# EAGLE design Omnimem (EAGLE 6.6.0)

## Sheet 1 of 3
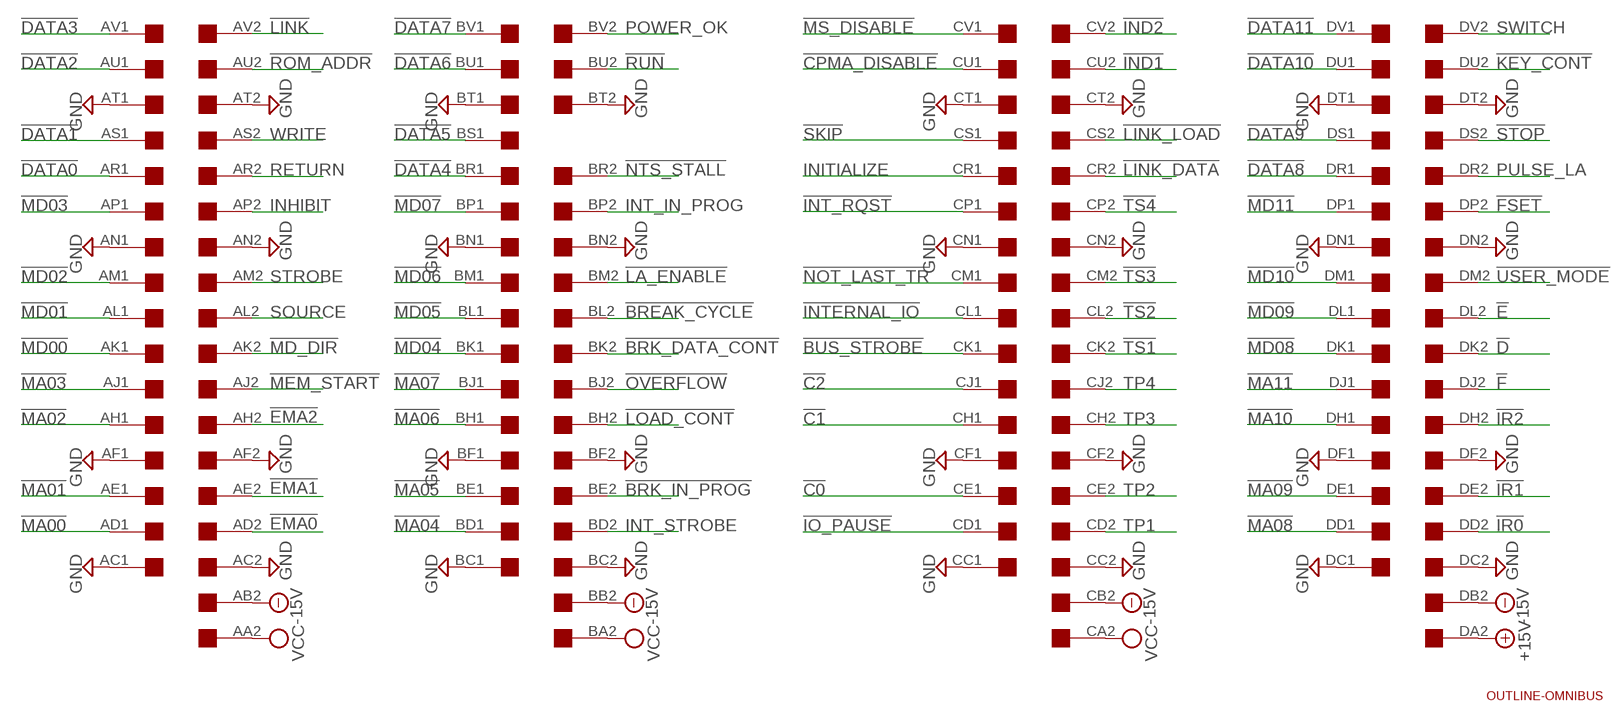
[diagram p0: schematic, sheet 1]

### Parts
U$1  OUTLINE-OMNIBUS  [OMNIBUS]
U$2  QUAD  [EDGE-CON8]

### Nets
!BREAK_CYCLE: U$2.BL2
!BRK_DATA_CONT: U$2.BK2
!BRK_IN_PROG: U$2.BE2
!BUS_STROBE: U$2.CK1
!C0: U$2.CE1
!C1: U$2.CH1
!C2: U$2.CJ1
!CPMA_DISABLE: U$2.CU1
!D: U$2.DK2
!DATA0: U$2.AR1
!DATA1: U$2.AS1
!DATA2: U$2.AU1
!DATA3: U$2.AV1
!DATA4: U$2.BR1
!DATA5: U$2.BS1
!DATA6: U$2.BU1
!DATA7: U$2.BV1
!DATA8: U$2.DR1
!DATA9: U$2.DS1
!DATA10: U$2.DU1
!DATA11: U$2.DV1
!E: U$2.DL2
!EMA0: U$2.AD2 ; also sheet 2
!EMA1: U$2.AE2 ; also sheet 2
!EMA2: U$2.AH2 ; also sheet 2
!F: U$2.DJ2
!FSET: U$2.DP2
!IND1: U$2.CU2
!IND2: U$2.CV2
!INT_RQST: U$2.CP1
!INTERNAL_IO: U$2.CL1
!IO_PAUSE: U$2.CD1
!IR0: U$2.DD2
!IR1: U$2.DE2
!IR2: U$2.DH2
!KEY_CONT: U$2.DU2
!LA_ENABLE: U$2.BM2
!LINK: U$2.AV2
!LINK_DATA: U$2.CR2
!LINK_LOAD: U$2.CS2
!LOAD_CONT: U$2.BH2
!MA00: U$2.AD1 ; also sheet 2
!MA01: U$2.AE1 ; also sheet 2
!MA02: U$2.AH1 ; also sheet 2
!MA03: U$2.AJ1 ; also sheet 2
!MA04: U$2.BD1 ; also sheet 2
!MA05: U$2.BE1 ; also sheet 2
!MA06: U$2.BH1 ; also sheet 2
!MA07: U$2.BJ1 ; also sheet 2
!MA08: U$2.DD1 ; also sheet 2
!MA09: U$2.DE1 ; also sheet 2
!MA10: U$2.DH1 ; also sheet 2
!MA11: U$2.DJ1 ; also sheet 2
!MD00: U$2.AK1 ; also sheet 2
!MD01: U$2.AL1 ; also sheet 2
!MD02: U$2.AM1 ; also sheet 2
!MD03: U$2.AP1 ; also sheet 2
!MD04: U$2.BK1 ; also sheet 2
!MD05: U$2.BL1 ; also sheet 2
!MD06: U$2.BM1 ; also sheet 2
!MD07: U$2.BP1 ; also sheet 2
!MD08: U$2.DK1 ; also sheet 2
!MD09: U$2.DL1 ; also sheet 2
!MD10: U$2.DM1 ; also sheet 2
!MD11: U$2.DP1 ; also sheet 2
!MD_DIR: U$2.AK2
!MEM_START: U$2.AJ2
!MS_DISABLE: U$2.CV1
!NOT_LAST_TR: U$2.CM1
!NTS_STALL: U$2.BR2
!OVERFLOW: U$2.BJ2
!ROM_ADDR: U$2.AU2 ; also sheet 2
!RUN: U$2.BU2
!SKIP: U$2.CS1
!STOP: U$2.DS2
!TS1: U$2.CK2
!TS2: U$2.CL2
!TS3: U$2.CM2
!TS4: U$2.CP2
!USER_MODE: U$2.DM2
+15V: U$2.DA2
-15V [supply]: U$2.AB2 U$2.BB2 U$2.CB2 U$2.DB2
GND [supply]: U$2.AC1 U$2.AC2 U$2.AF1 U$2.AF2 U$2.AN1 U$2.AN2 U$2.AT1 U$2.AT2 U$2.BC1 U$2.BC2 U$2.BF1 U$2.BF2 U$2.BN1 U$2.BN2 U$2.BT1 U$2.BT2 U$2.CC1 U$2.CC2 U$2.CF1 U$2.CF2 U$2.CN1 U$2.CN2 U$2.CT1 U$2.CT2 U$2.DC1 U$2.DC2 U$2.DF1 U$2.DF2 U$2.DN1 U$2.DN2 U$2.DT1 U$2.DT2 ; also sheet 2,3
INHIBIT: U$2.AP2
INITIALIZE: U$2.CR1
INT_IN_PROG: U$2.BP2
INT_STROBE: U$2.BD2
POWER_OK: U$2.BV2
PULSE_LA: U$2.DR2
RETURN: U$2.AR2
SOURCE: U$2.AL2
STROBE: U$2.AM2
SWITCH: U$2.DV2
TP1: U$2.CD2
TP2: U$2.CE2
TP3: U$2.CH2
TP4: U$2.CJ2
VCC [supply]: U$2.AA2 U$2.BA2 U$2.CA2 ; also sheet 2
WRITE: U$2.AS2 ; also sheet 2
Unconnected: U$2.AA1 U$2.AB1 U$2.BA1 U$2.BB1 U$2.BS2 U$2.CA1 U$2.CB1 U$2.DA1 U$2.DB1

## Sheet 2 of 3
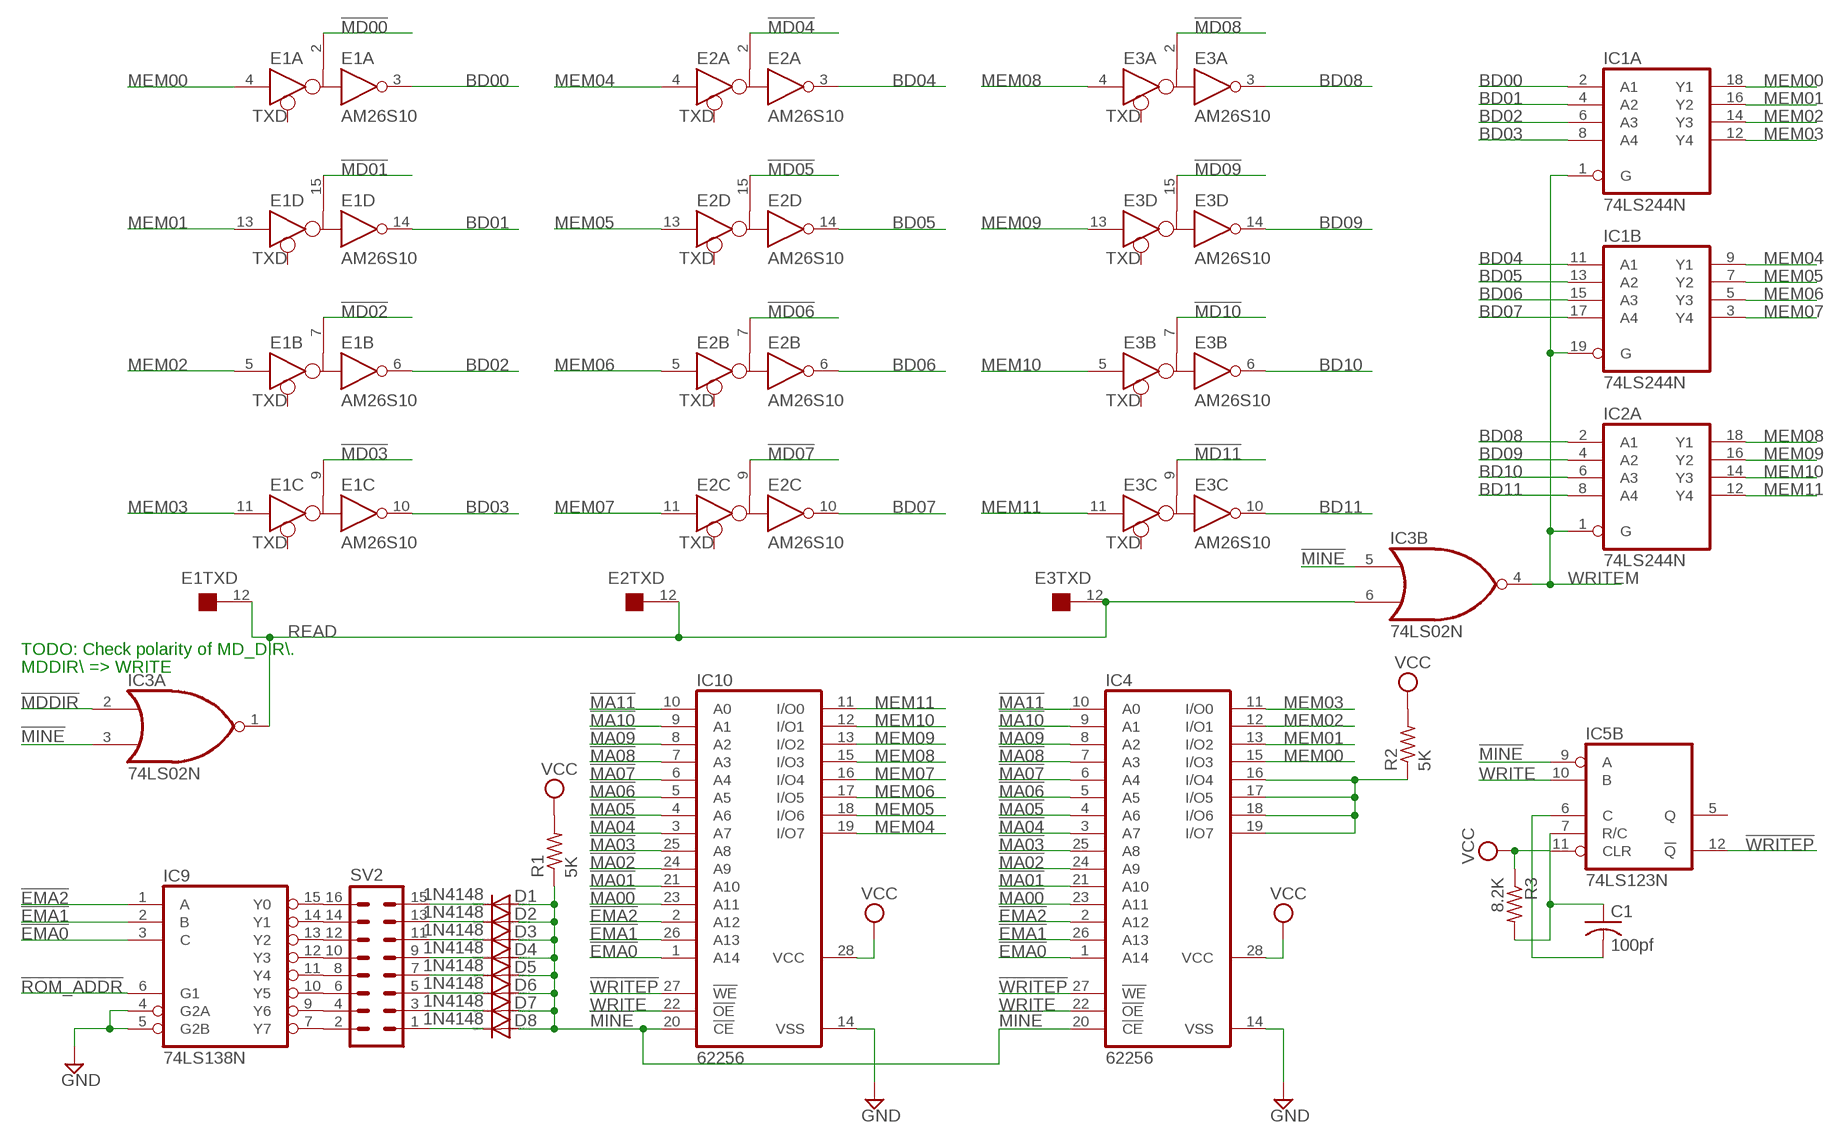
[diagram p1: schematic, sheet 2]

### Parts
C1  100pf  C-US050-025X075  [C050-025X075]
D1  1N4148  1N4148DO35-10  [DO35-10]
D2  1N4148  1N4148DO35-10  [DO35-10]
D3  1N4148  1N4148DO35-10  [DO35-10]
D4  1N4148  1N4148DO35-10  [DO35-10]
D5  1N4148  1N4148DO35-10  [DO35-10]
D6  1N4148  1N4148DO35-10  [DO35-10]
D7  1N4148  1N4148DO35-10  [DO35-10]
D8  1N4148  1N4148DO35-10  [DO35-10]
E1  AM26S10  [DIL16]
E2  AM26S10  [DIL16]
E3  AM26S10  [DIL16]
IC1  74LS244N  [DIL20]
IC2  74LS244N  [DIL20]
IC3  74LS02N  [DIL14]
IC4  62256  58C256P  [DIL28-6]
IC5  74LS123N  [DIL16]
IC9  74LS138N  [DIL16]
IC10  62256  58C256P  [DIL28-6]
R1  5K  R-US_0207/10  [0207/10]
R2  5K  R-US_0207/10  [0207/10]
R3  8.2K  R-US_0207/10  [0207/10]
SV2  MA08-2  [MA08-2]

### Nets
!EMA0: IC4.1(A14) IC9.3(C) IC10.1(A14) ; also sheet 1
!EMA1: IC4.26(A13) IC9.2(B) IC10.26(A13) ; also sheet 1
!EMA2: IC4.2(A12) IC9.1(A) IC10.2(A12) ; also sheet 1
!MA00: IC4.23(A11) IC10.23(A11) ; also sheet 1
!MA01: IC4.21(A10) IC10.21(A10) ; also sheet 1
!MA02: IC4.24(A9) IC10.24(A9) ; also sheet 1
!MA03: IC4.25(A8) IC10.25(A8) ; also sheet 1
!MA04: IC4.3(A7) IC10.3(A7) ; also sheet 1
!MA05: IC4.4(A6) IC10.4(A6) ; also sheet 1
!MA06: IC4.5(A5) IC10.5(A5) ; also sheet 1
!MA07: IC4.6(A4) IC10.6(A4) ; also sheet 1
!MA08: IC4.7(A3) IC10.7(A3) ; also sheet 1
!MA09: IC4.8(A2) IC10.8(A2) ; also sheet 1
!MA10: IC4.9(A1) IC10.9(A1) ; also sheet 1
!MA11: IC4.10(A0) IC10.10(A0) ; also sheet 1
!MD00: E1.2(A:B) ; also sheet 1
!MD01: E1.15(D:B) ; also sheet 1
!MD02: E1.7(B:B) ; also sheet 1
!MD03: E1.9(C:B) ; also sheet 1
!MD04: E2.2(A:B) ; also sheet 1
!MD05: E2.15(D:B) ; also sheet 1
!MD06: E2.7(B:B) ; also sheet 1
!MD07: E2.9(C:B) ; also sheet 1
!MD08: E3.2(A:B) ; also sheet 1
!MD09: E3.15(D:B) ; also sheet 1
!MD10: E3.7(B:B) ; also sheet 1
!MD11: E3.9(C:B) ; also sheet 1
!MDDIR: IC3.2(A:I0)
!MINE: D1.A D2.A D3.A D4.A D5.A D6.A D7.A D8.A IC3.3(A:I1) IC3.5(B:I0) IC4.20(!CE) IC5.9(B:A) IC10.20(!CE) R1.1
!ROM_ADDR: IC9.6(G1) ; also sheet 1
!WRITEP: IC4.27(!WE) IC5.12(B:!Q) IC10.27(!WE)
BD00: E1.3(A:R) IC1.2(A:A1)
BD01: E1.14(D:R) IC1.4(A:A2)
BD02: E1.6(B:R) IC1.6(A:A3)
BD03: E1.10(C:R) IC1.8(A:A4)
BD04: E2.3(A:R) IC1.11(B:A1)
BD05: E2.14(D:R) IC1.13(B:A2)
BD06: E2.6(B:R) IC1.15(B:A3)
BD07: E2.10(C:R) IC1.17(B:A4)
BD08: E3.3(A:R) IC2.2(A:A1)
BD09: E3.14(D:R) IC2.4(A:A2)
BD10: E3.6(B:R) IC2.6(A:A3)
BD11: E3.10(C:R) IC2.8(A:A4)
GND [supply]: IC4.14(VSS) IC9.4(G2A) IC9.5(G2B) IC10.14(VSS) ; also sheet 1,3
MEM00: E1.4(A:D) IC1.18(A:Y1) IC4.15(I/O3)
MEM01: E1.13(D:D) IC1.16(A:Y2) IC4.13(I/O2)
MEM02: E1.5(B:D) IC1.14(A:Y3) IC4.12(I/O1)
MEM03: E1.11(C:D) IC1.12(A:Y4) IC4.11(I/O0)
MEM04: E2.4(A:D) IC1.9(B:Y1) IC10.19(I/O7)
MEM05: E2.13(D:D) IC1.7(B:Y2) IC10.18(I/O6)
MEM06: E2.5(B:D) IC1.5(B:Y3) IC10.17(I/O5)
MEM07: E2.11(C:D) IC1.3(B:Y4) IC10.16(I/O4)
MEM08: E3.4(A:D) IC2.18(A:Y1) IC10.15(I/O3)
MEM09: E3.13(D:D) IC2.16(A:Y2) IC10.13(I/O2)
MEM10: E3.5(B:D) IC2.14(A:Y3) IC10.12(I/O1)
MEM11: E3.11(C:D) IC2.12(A:Y4) IC10.11(I/O0)
N$1: IC9.7(Y7) SV2.2
N$18: IC9.9(Y6) SV2.4
N$19: IC9.10(Y5) SV2.6
N$20: IC9.11(Y4) SV2.8
N$21: IC9.12(Y3) SV2.10
N$22: IC9.13(Y2) SV2.12
N$23: IC9.14(Y1) SV2.14
N$24: IC9.15(Y0) SV2.16
N$25: C1.1 IC5.7(B:R/C) R3.2
N$26: D8.C SV2.1
N$27: D7.C SV2.3
N$28: D6.C SV2.5
N$29: D5.C SV2.7
N$30: D4.C SV2.9
N$31: D3.C SV2.11
N$32: D2.C SV2.13
N$33: D1.C SV2.15
N$34: C1.2 IC5.6(B:C)
N$35: IC4.16(I/O4) IC4.17(I/O5) IC4.18(I/O6) IC4.19(I/O7) R2.1
READ: E1.12(TXD:TXD) E2.12(TXD:TXD) E3.12(TXD:TXD) IC3.1(A:O) IC3.6(B:I1)
VCC [supply]: IC4.28(VCC) IC5.11(B:CLR) IC10.28(VCC) R1.2 R2.2 R3.1 ; also sheet 1
WRITE: IC4.22(!OE) IC5.10(B:B) IC10.22(!OE) ; also sheet 1
WRITEM: IC1.1(A:G) IC1.19(B:G) IC2.1(A:G) IC3.4(B:O)
Unconnected: IC2.3(B:Y4) IC2.5(B:Y3) IC2.7(B:Y2) IC2.9(B:Y1) IC2.11(B:A1) IC2.13(B:A2) IC2.15(B:A3) IC2.17(B:A4) IC2.19(B:G) IC3.8(C:I0) IC3.9(C:I1) IC3.10(C:O) IC3.11(D:I0) IC3.12(D:I1) IC3.13(D:O) IC5.1(A:A) IC5.2(A:B) IC5.3(A:CLR) IC5.4(A:!Q) IC5.5(B:Q) IC5.13(A:Q) IC5.14(A:C) IC5.15(A:R/C)

### Notes on the sheet
- TODO: Check polarity of MD_DIR\\.
- MDDIR\\ => WRITE

## Sheet 3 of 3
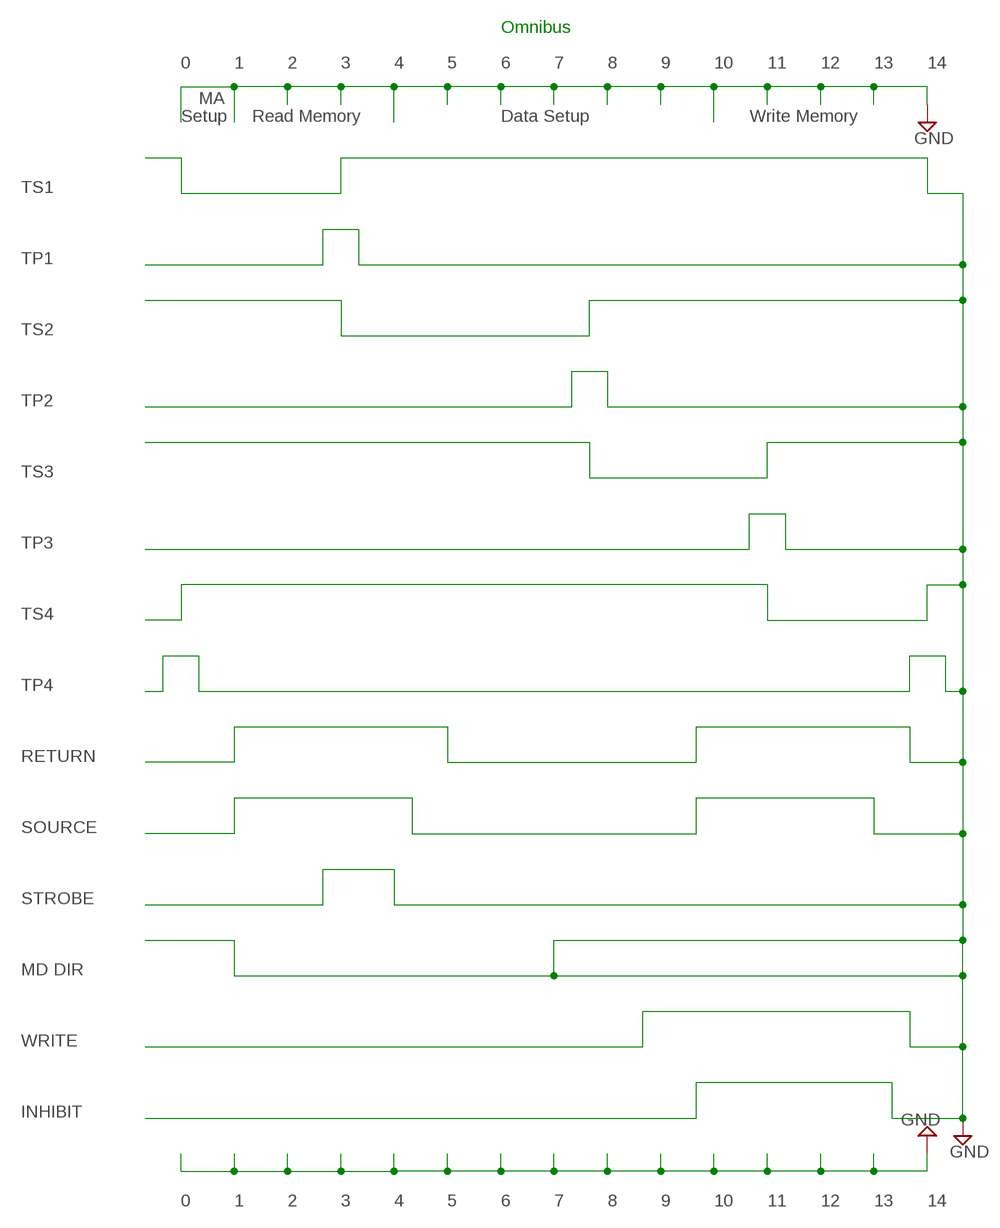
[diagram p2: schematic, sheet 3]

### Notes on the sheet
- Omnibus
- 0 | 1 | 2 | 3 | 4 | 5 | 6 | 7 | 8 | 9 | 10 | 11 | 12 | 13 | 14
- MA
- Setup | Read Memory | Data Setup | Write Memory
- TS1
- TP1
- TS2
- TP2
- TS3
- TP3
- TS4
- TP4
- RETURN
- SOURCE
- STROBE
- MD DIR
- WRITE
- INHIBIT
- 0 | 1 | 2 | 3 | 4 | 5 | 6 | 7 | 8 | 9 | 10 | 11 | 12 | 13 | 14

## Power pins joined to a net without a drawn wire
GND: E1.1(GND:GND) E1.8(PWR:GND) E2.1(GND:GND) E2.8(PWR:GND) E3.1(GND:GND) E3.8(PWR:GND) IC1.10(P:GND) IC2.10(P:GND) IC3.7(P:GND) IC5.8(P:GND) IC9.8(GND)
VCC: E1.16(PWR:VCC) E2.16(PWR:VCC) E3.16(PWR:VCC) IC1.20(P:VCC) IC2.20(P:VCC) IC3.14(P:VCC) IC5.16(P:VCC) IC9.16(VCC)

## Library data of the parts
C1 = rcl:C-US: CAPACITOR, American symbol
D1-D8 = diode:1N4148: DIODE high speed (Philips)
E1-E3 = dec-con:AM26S10: Bus Transceiver
IC1 IC2 = 74xx-us:74*244: Octal BUFFER and LINE DRIVER, 3-state
IC3 = 74xx-us:74*02: Quad 2-input NOR gate
IC4 IC10 = memory-hitachi:58C256P: MEMORY; MPN: HN58C256AP85E; OC_FARNELL: 1496447; OC_NEWARK: 61M6616
IC5 = 74xx-us:74*123: Retriggerable monostable MULTIVIBRATOR
IC9 = 74xx-us:74*138: 3-line to 8-line DECODER/DEMULTIPLEXER
R1-R3 = rcl:R-US_: RESISTOR, American symbol
SV2 = con-lstb:MA08-2: PIN HEADER; OC_FARNELL: unknown; OC_NEWARK: unknown
U$1 = dec-con:OUTLINE-*: Board outlines for DEC boards.
U$2 = dec-con:QUAD: Quad-Height DEC board

## Net classes
1 supply: width 0.762 mm

## Board
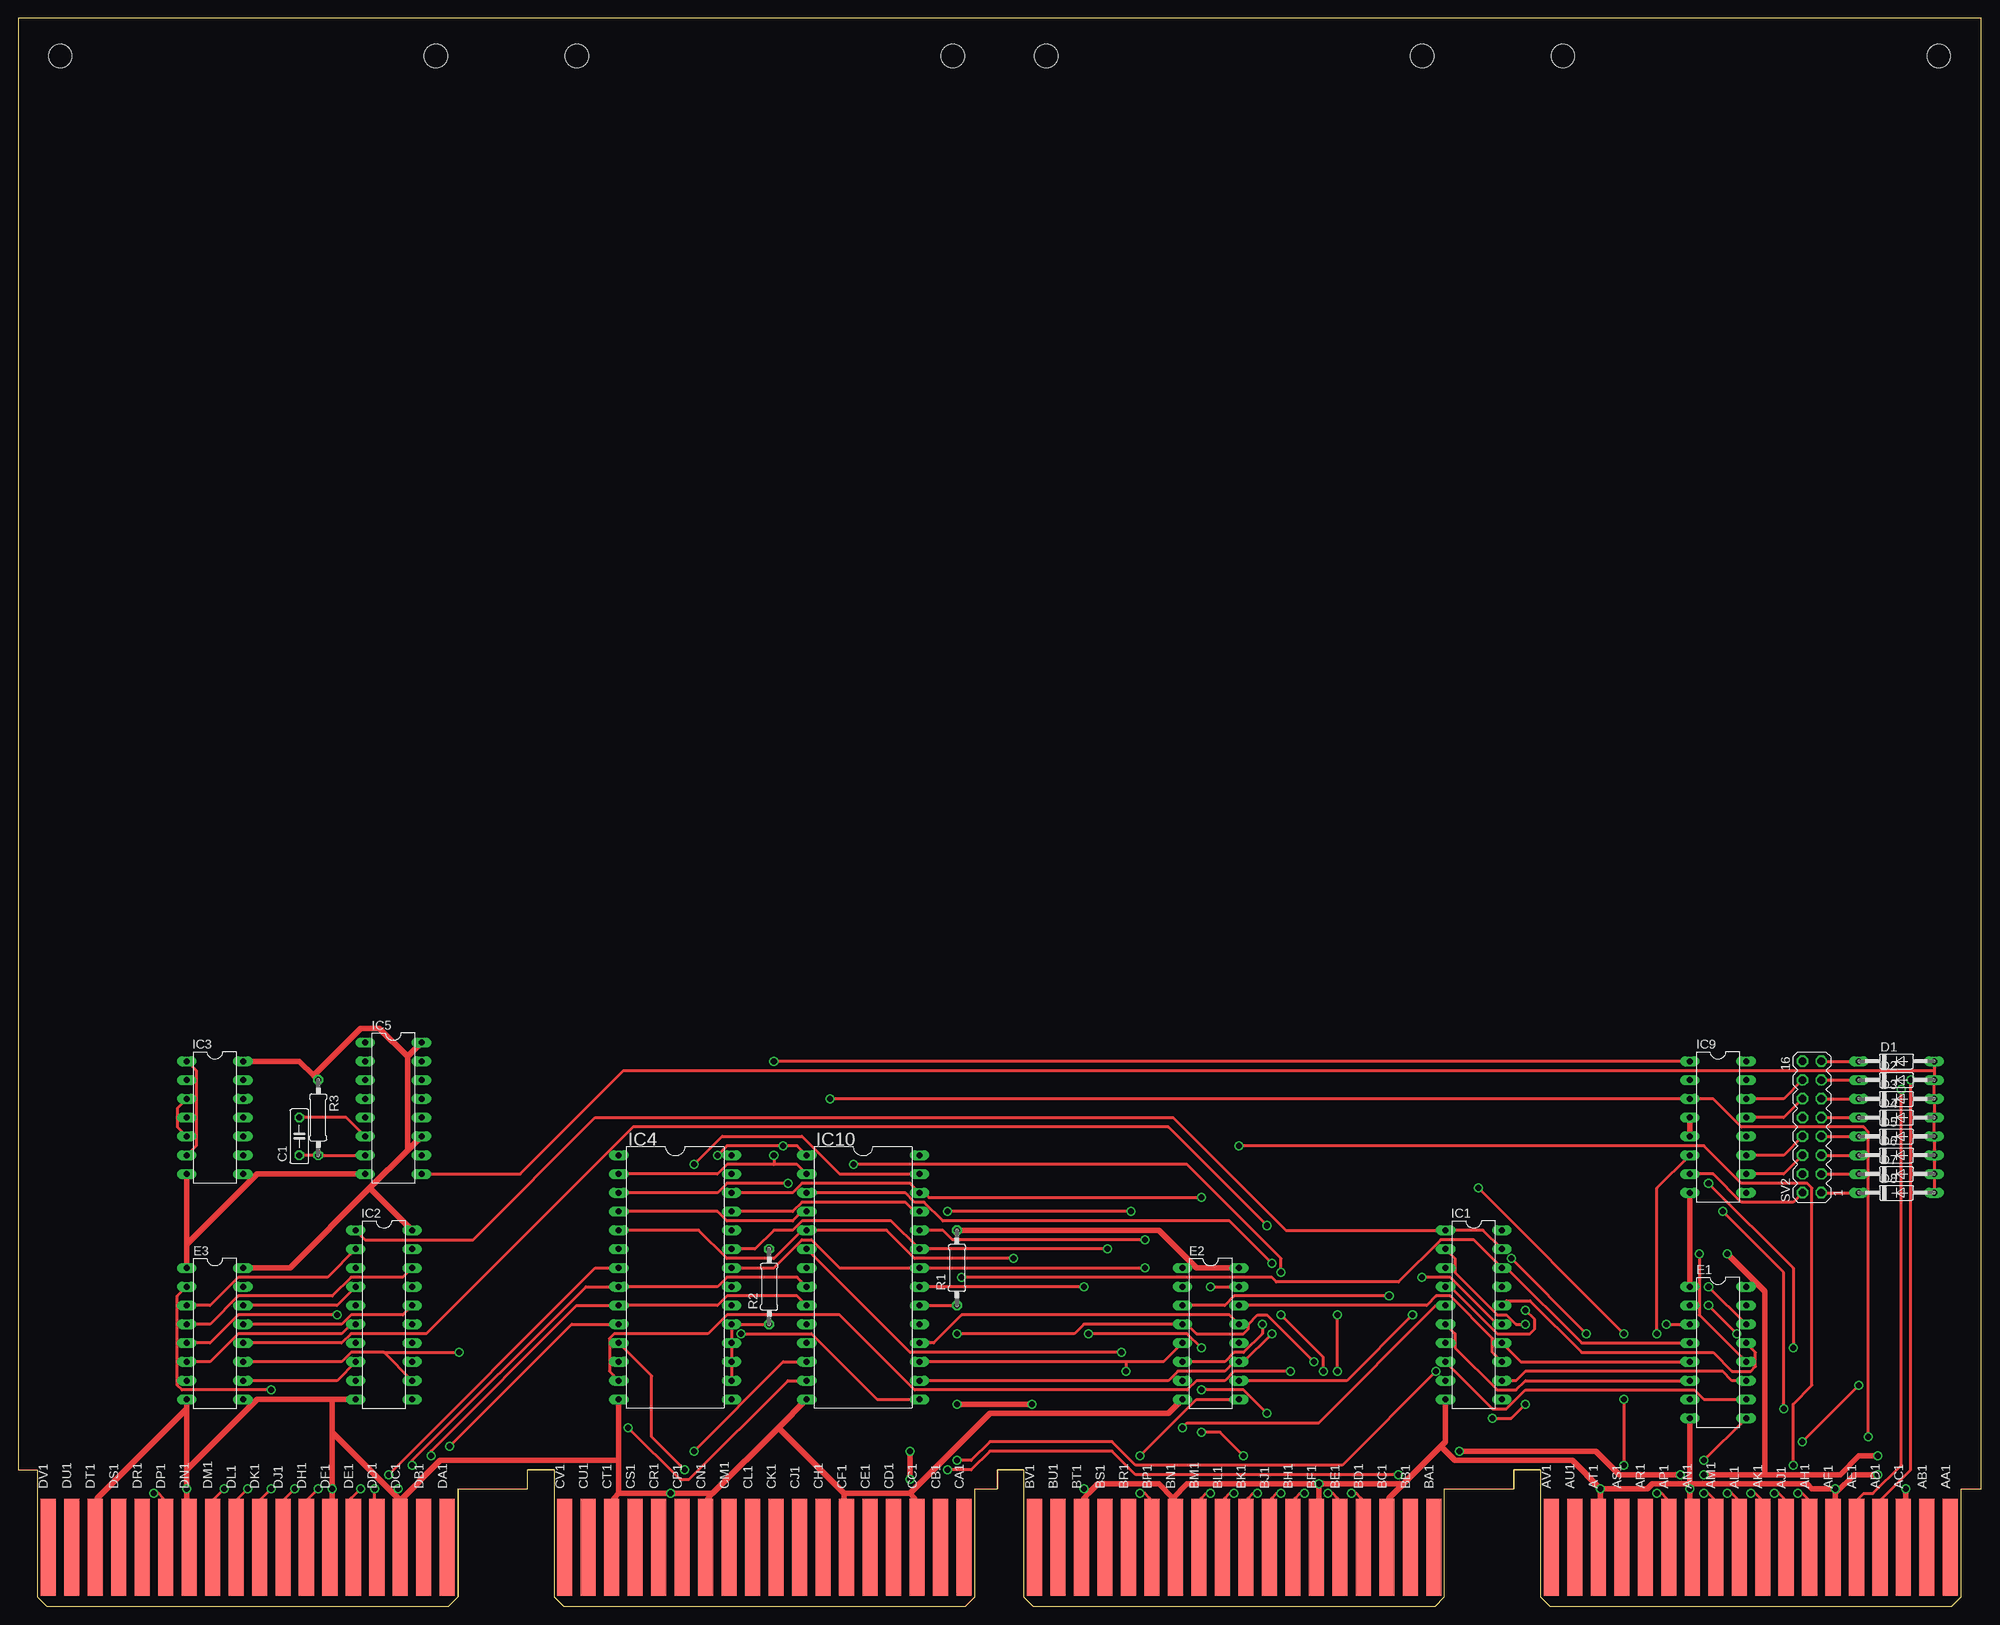
[diagram p3: board, top side]
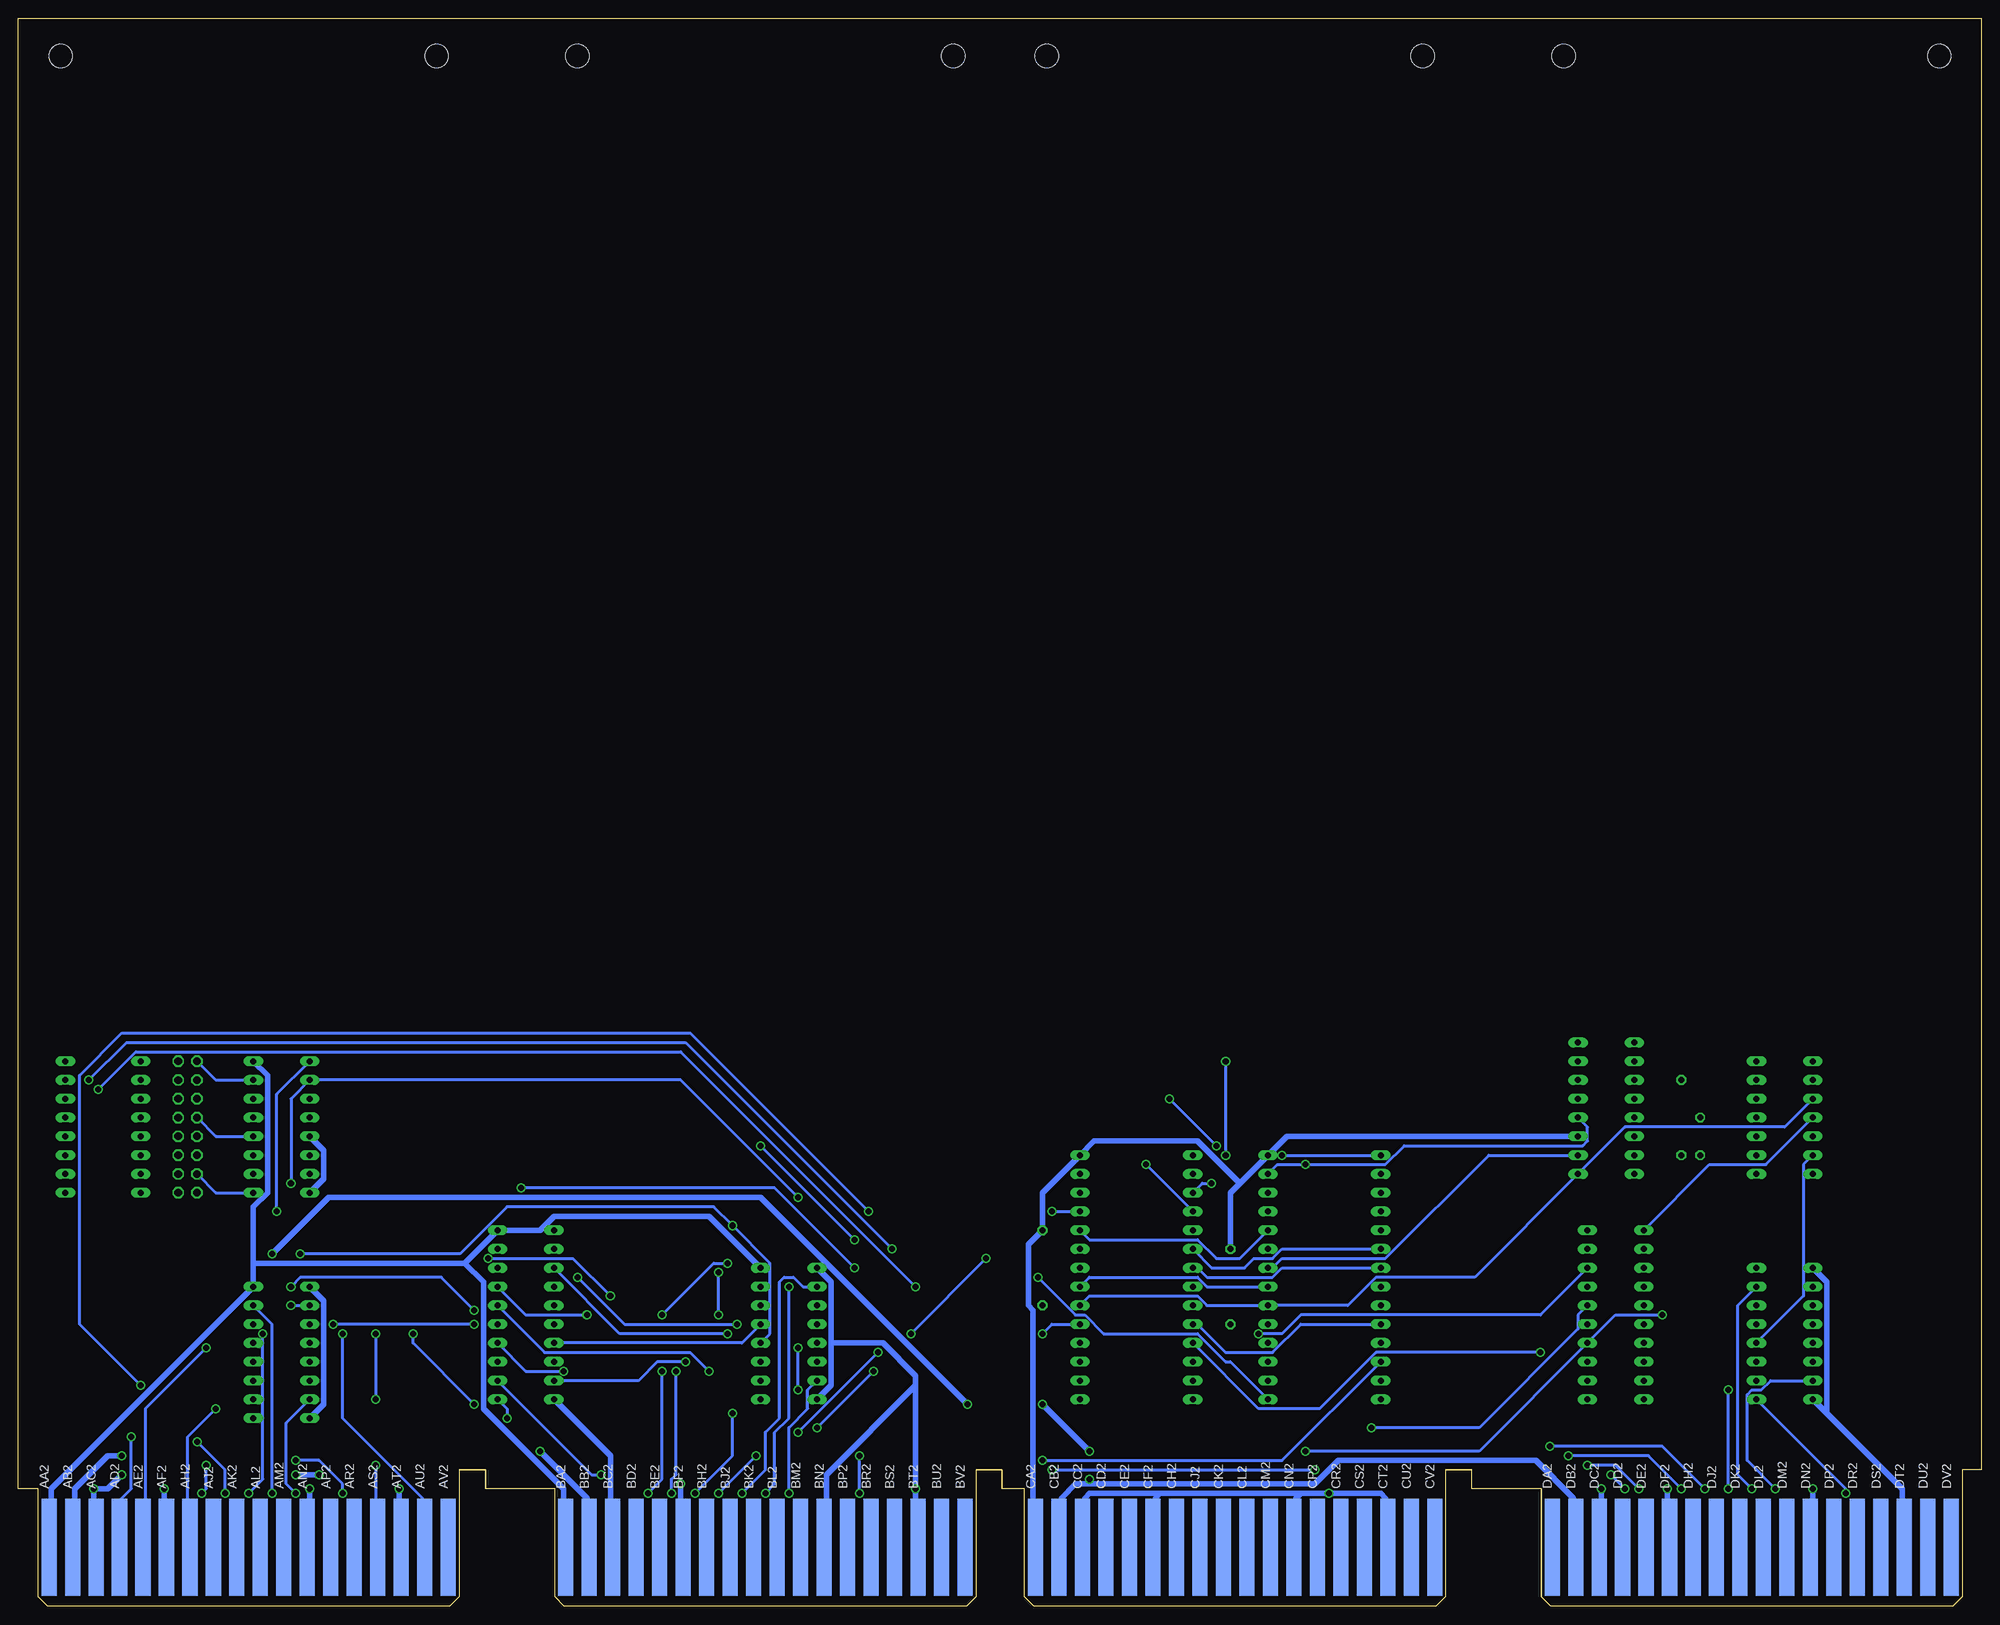
[diagram p4: board, bottom side, seen from below]

Size 265.3 x 214.63 mm. Coordinates in mm from the lower left corner, seen from the top.
Copper layers (1+16): Top 0.035mm / dielectric 1.5mm / Bottom 0.035mm
Design rules "16mils": minimum track width 16mil, minimum drill 32mil, track to track 15mil, track to pad 10mil, pad to pad 10mil, via to via 10mil, smd to smd 10mil, copper to edge 13mil, drill to drill 10mil, minimum pad ring 10mil, minimum via ring 8mil, stop-mask expansion 0mil, vias tented up to drill 0mil, thermal gap 10mil

### Footprints (pad centres in the part's own frame; a part is rotated, then mirrored left to right if it is on the bottom)
C050-025X075 = drill 0.813 octagon: 1 -2.54,0; 2 2.54,0
DO35-10 = drill 0.813 long: A 5.08,0; C -5.08,0
DIL16 = drill 0.813 long: 1 -8.89,-3.81; 2 -6.35,-3.81; 3 -3.81,-3.81; 4 -1.27,-3.81; 5 1.27,-3.81; 6 3.81,-3.81; 7 6.35,-3.81; 8 8.89,-3.81; 9 8.89,3.81; 10 6.35,3.81; 11 3.81,3.81; 12 1.27,3.81; 13 -1.27,3.81; 14 -3.81,3.81; 15 -6.35,3.81; 16 -8.89,3.81
DIL20 = drill 0.813 long: 1 -11.43,-3.81; 2 -8.89,-3.81; 3 -6.35,-3.81; 4 -3.81,-3.81; 5 -1.27,-3.81; 6 1.27,-3.81; 7 3.81,-3.81; 8 6.35,-3.81; 9 8.89,-3.81; 10 11.43,-3.81; 11 11.43,3.81; 12 8.89,3.81; 13 6.35,3.81; 14 3.81,3.81; 15 1.27,3.81; 16 -1.27,3.81; 17 -3.81,3.81; 18 -6.35,3.81; 19 -8.89,3.81; 20 -11.43,3.81
DIL14 = drill 0.813 long: 1 -7.62,-3.81; 2 -5.08,-3.81; 3 -2.54,-3.81; 4 0,-3.81; 5 2.54,-3.81; 6 5.08,-3.81; 7 7.62,-3.81; 8 7.62,3.81; 9 5.08,3.81; 10 2.54,3.81; 11 0,3.81; 12 -2.54,3.81; 13 -5.08,3.81; 14 -7.62,3.81
DIL28-6 = drill 0.813 long: 1 -16.51,-7.62; 2 -13.97,-7.62; 3 -11.43,-7.62; 4 -8.89,-7.62; 5 -6.35,-7.62; 6 -3.81,-7.62; 7 -1.27,-7.62; 8 1.27,-7.62; 9 3.81,-7.62; 10 6.35,-7.62; 11 8.89,-7.62; 12 11.43,-7.62; 13 13.97,-7.62; 14 16.51,-7.62; 15 16.51,7.62; 16 13.97,7.62; 17 11.43,7.62; 18 8.89,7.62; 19 6.35,7.62; 20 3.81,7.62; 21 1.27,7.62; 22 -1.27,7.62; 23 -3.81,7.62; 24 -6.35,7.62; 25 -8.89,7.62; 26 -11.43,7.62; 27 -13.97,7.62; 28 -16.51,7.62
0207/10 = drill 0.813 octagon: 1 -5.08,0; 2 5.08,0
MA08-2 = drill 1.016 octagon: 1 -8.89,-1.27; 2 -8.89,1.27; 3 -6.35,-1.27; 4 -6.35,1.27; 5 -3.81,-1.27; 6 -3.81,1.27; 7 -1.27,-1.27; 8 -1.27,1.27; 9 1.27,-1.27; 10 1.27,1.27; 11 3.81,-1.27; 12 3.81,1.27; 13 6.35,-1.27; 14 6.35,1.27; 15 8.89,-1.27; 16 8.89,1.27
OMNIBUS = hole 3.175: 208.915,209.55; 259.715,209.55; 189.865,209.55; 139.065,209.55; 75.616,209.55; 126.416,209.55; 56.566,209.55; 5.766,209.55
EDGE-CON8 = smd 2.032 x 13.106: AA1 261.303,7.938; AB1 258.127,7.938; AC1 254.952,7.938; AD1 251.778,7.938; AE1 248.602,7.938; AF1 245.428,7.938; AH1 242.252,7.938; AJ1 239.077,7.938; AK1 235.903,7.938; AL1 232.727,7.938; AM1 229.553,7.938; AN1 226.377,7.938; AP1 223.202,7.938; AR1 220.028,7.938; AS1 216.852,7.938; AT1 213.678,7.938; AU1 210.502,7.938; AV1 207.327,7.938; BA1 191.452,7.938; BB1 188.278,7.938; BC1 185.102,7.938; BD1 181.928,7.938; BE1 178.752,7.938; BF1 175.577,7.938; BH1 172.403,7.938; BJ1 169.227,7.938; BK1 166.053,7.938; BL1 162.877,7.938; BM1 159.702,7.938; BN1 156.528,7.938; BP1 153.352,7.938; BR1 150.178,7.938; BS1 147.002,7.938; BT1 143.827,7.938; BU1 140.653,7.938; BV1 137.477,7.938; CA1 127.953,7.938; CB1 124.778,7.938; CC1 121.603,7.938; CD1 118.427,7.938; CE1 115.252,7.938; CF1 112.078,7.938; CH1 108.903,7.938; CJ1 105.728,7.938; CK1 102.552,7.938; CL1 99.377,7.938; CM1 96.203,7.938; CN1 93.028,7.938; CP1 89.853,7.938; CR1 86.677,7.938; CS1 83.502,7.938; CT1 80.328,7.938; CU1 77.153,7.938; CV1 73.978,7.938; DA1 58.102,7.938; DB1 54.928,7.938; DC1 51.752,7.938; DD1 48.578,7.938; DE1 45.403,7.938; DF1 42.227,7.938; DH1 39.053,7.938; DJ1 35.877,7.938; DK1 32.703,7.938; DL1 29.527,7.938; DM1 26.352,7.938; DN1 23.177,7.938; DP1 20.003,7.938; DR1 16.828,7.938; DS1 13.652,7.938; DT1 10.477,7.938; DU1 7.303,7.938; DV1 4.128,7.938 | smd 2.032 x 13.106 bottom: AA2 261.303,7.938; AB2 258.127,7.938; AC2 254.952,7.938; AD2 251.778,7.938; AE2 248.602,7.938; AF2 245.428,7.938; AH2 242.252,7.938; AJ2 239.077,7.938; AK2 235.903,7.938; AL2 232.727,7.938; AM2 229.553,7.938; AN2 226.377,7.938; AP2 223.202,7.938; AR2 220.028,7.938; AS2 216.852,7.938; AT2 213.678,7.938; AU2 210.502,7.938; AV2 207.327,7.938; BA2 191.452,7.938; BB2 188.278,7.938; BC2 185.102,7.938; BD2 181.928,7.938; BE2 178.752,7.938; BF2 175.577,7.938; BH2 172.403,7.938; BJ2 169.227,7.938; BK2 166.053,7.938; BL2 162.877,7.938; BM2 159.702,7.938; BN2 156.528,7.938; BP2 153.352,7.938; BR2 150.178,7.938; BS2 147.002,7.938; BT2 143.827,7.938; BU2 140.653,7.938; BV2 137.477,7.938; CA2 127.953,7.938; CB2 124.778,7.938; CC2 121.603,7.938; CD2 118.427,7.938; CE2 115.252,7.938; CF2 112.078,7.938; CH2 108.903,7.938; CJ2 105.728,7.938; CK2 102.552,7.938; CL2 99.377,7.938; CM2 96.203,7.938; CN2 93.028,7.938; CP2 89.853,7.938; CR2 86.677,7.938; CS2 83.502,7.938; CT2 80.328,7.938; CU2 77.153,7.938; CV2 73.978,7.938; DA2 58.102,7.938; DB2 54.928,7.938; DC2 51.752,7.938; DD2 48.578,7.938; DE2 45.403,7.938; DF2 42.227,7.938; DH2 39.053,7.938; DJ2 35.877,7.938; DK2 32.703,7.938; DL2 29.527,7.938; DM2 26.352,7.938; DN2 23.177,7.938; DP2 20.003,7.938; DR2 16.828,7.938; DS2 13.652,7.938; DT2 10.477,7.938; DU2 7.303,7.938; DV2 4.128,7.938

### Placement (x,y rotation side)
C1  37.97,63.5 90 top
D1  253.87,73.66 0 top
D2  253.87,71.12 0 top
D3  253.87,68.58 0 top
D4  253.87,66.04 0 top
D5  253.87,63.5 0 top
D6  253.87,60.96 0 top
D7  253.87,58.42 0 top
D8  253.87,55.88 0 top
E1  229.74,34.29 270 top
E2  161.16,36.83 270 top
E3  26.54,36.83 270 top
IC1  196.72,39.37 270 top
IC2  49.4,39.37 270 top
IC3  26.54,66.04 270 top
IC4  88.77,44.45 270 top
IC5  50.67,67.31 270 top
IC9  229.74,64.77 270 top
IC10  114.17,44.45 270 top
R1  126.87,45.72 90 top
R2  101.47,43.18 90 top
R3  40.51,66.04 270 top
SV2  242.44,64.77 90 top
U$1  -0.13,0 0 top
U$2  -0.13,0 0 top

### Tracks (layer width: path | path; a pad name or v marks a point on that pad's centre or on a via)
!EMA0  (via drill 0.81)
  Top 0.406: v94.49,60.96 95.76,62.23 v103.38,62.23 105.28,62.23 IC10.1 | v250.06,22.86 250.06,64.14 249.43,64.77 232.92,64.77 229.11,68.58 IC9.3 v109.73,68.58
  Bottom 0.406: v94.49,60.96 IC4.1 | v250.06,22.86 250.06,15.88 251.33,14.61 251.33,8.26 U$2.AD2 | v109.73,68.58 v103.38,62.23
!EMA1  (via drill 0.81)
  Top 0.406: IC4.26 104.65,55.88 105.92,57.15 120.52,57.15 IC10.26 122.43,55.88 123.06,55.24 v159.89,55.24 | v239.9,34.92 239.9,45.72 v228.47,57.15
  Bottom 0.406: v159.89,55.24 175.77,71.12 IC9.2 228.47,68.58 v228.47,57.15 | v239.9,34.92 248.16,26.67 248.16,8.26 U$2.AE2
!EMA2  (via drill 0.81)
  Top 0.406: IC4.2 94.49,58.42 95.76,59.69 102.11,59.69 | 102.11,59.69 105.28,59.69 IC10.2 | v230.38,53.34 238.63,45.09 v238.63,26.67 | v102.11,60.96 102.11,59.69 | IC9.1 v102.11,73.66
  Bottom 0.406: IC9.1 230.38,69.22 v230.38,53.34 | v238.63,26.67 242.44,22.86 242.44,8.26 U$2.AH2 | v102.11,73.66 v102.11,60.96
!MA00  (via drill 0.81)
  Top 0.406: IC4.23 99.57,48.26 102.11,50.8 104.65,50.8 105.92,52.07 117.98,52.07 IC10.23 v147.19,48.26 | v255.78,71.12 255.78,18.41 251.97,14.61 251.97,8.26 U$2.AD1
  Bottom 0.406: v147.19,48.26 175.13,76.2 250.7,76.2 v255.78,71.12
!MA01  (via drill 0.81)
  Top 0.406: v144.02,43.18 IC10.21 | v254.51,69.85 254.51,19.05 250.7,15.24 249.43,15.24 248.79,14.61 248.79,8.26 U$2.AE1
  Bottom 0.406: IC4.21 104.65,43.18 105.92,44.45 120.52,44.45 IC10.21 | v144.02,43.18 175.77,74.93 249.43,74.93 v254.51,69.85
!MA02  (via drill 0.81)
  Top 0.406: IC10.24 124.97,50.8 126.24,49.53 v152.27,49.53 | v164.97,62.23 227.84,62.23 232.92,57.15 241.81,57.15 242.44,56.52 242.44,29.84 239.9,27.3 v239.9,19.05 | v240.54,15.24 241.17,15.24 241.81,14.61 241.81,8.26 U$2.AH1
  Bottom 0.406: IC4.24 100.2,46.99 103.38,46.99 105.92,49.53 120.52,49.53 IC10.24 | v164.97,62.23 v152.27,49.53 | v239.9,19.05 239.9,15.88 v240.54,15.24
!MA03  (via drill 0.81)
  Top 0.406: IC4.25 104.65,53.34 105.92,54.61 119.89,54.61 121.16,53.34 IC10.25 | v150.37,53.34 v125.6,53.34 | v241.17,22.23 v248.79,29.84 | v237.36,15.24 238,15.24 238.63,14.61 238.63,8.26 U$2.AJ1
  Bottom 0.406: v125.6,53.34 IC10.25 | v150.37,53.34 174.5,77.47 251.33,77.47 257.05,71.75 257.05,38.1 v248.79,29.84 | v241.17,22.23 237.36,18.41 v237.36,15.24
!MA04  (via drill 0.81)
  Top 0.406: IC4.3 94.49,55.88 95.76,57.15 v104.01,57.15 | IC10.3 119.89,55.88 121.16,54.61 122.43,54.61 124.97,52.07 163.7,52.07 v169.42,46.35 | v178.31,31.75 v178.31,39.37 | v180.21,15.24 180.85,15.24 181.48,14.61 181.48,8.26 U$2.BD1
  Bottom 0.406: v104.01,57.15 105.28,57.15 IC10.3 | v169.42,46.35 171.32,46.35 v178.31,39.37 | v178.31,31.75 178.31,17.14 v180.21,15.24
!MA05  (via drill 0.81)
  Top 0.406: IC4.4 94.49,53.34 95.76,52.07 104.65,52.07 105.92,53.34 IC10.4 | v112.9,59.69 157.99,59.69 170.69,46.99 v170.69,45.09 | v170.69,39.37 176.4,33.66 v176.4,31.75 | v177.04,15.24 177.67,15.24 178.31,14.61 178.31,8.26 U$2.BE1
  Bottom 0.406: v112.9,59.69 IC10.4 | v170.69,39.37 v170.69,45.09 | v176.4,31.75 176.4,17.78 177.04,17.14 v177.04,15.24
!MA06  (via drill 0.81)
  Top 0.406: IC4.5 91.95,50.8 95.76,46.99 102.11,46.99 105.92,50.8 IC10.5 117.35,50.8 121.16,46.99 v134.49,46.99 | v144.65,36.83 157.99,36.83 v159.89,34.92 | v159.89,29.21 165.61,29.21 v168.78,26.04 | v173.86,15.24 173.23,15.24 172.59,14.61 172.59,8.26 U$2.BH1
  Bottom 0.406: v144.65,36.83 v134.49,46.99 | v159.89,29.21 v159.89,34.92 | v168.78,26.04 168.78,20.32 v173.86,15.24
!MA07  (via drill 0.81)
  Top 0.406: IC10.6 120.52,34.29 v149.1,34.29 | v159.89,23.5 162.43,23.5 v165.61,20.32 | v170.69,15.24 170.05,15.24 169.42,14.61 169.42,8.26 U$2.BJ1
  Bottom 0.406: IC4.6 94.49,48.26 95.76,46.99 98.3,46.99 99.57,45.72 104.01,45.72 IC10.6 | v159.89,23.5 v149.1,34.29 | v170.69,15.24 v165.61,20.32
!MA08  (via drill 0.81)
  Top 0.406: IC4.7 77.98,45.72 v50.04,17.78 | v48.13,15.88 48.13,8.26 U$2.DD1
  Bottom 0.406: IC4.7 94.49,45.72 95.76,44.45 104.65,44.45 105.92,45.72 IC10.7 | v48.13,15.88 v50.04,17.78
!MA09  (via drill 0.81)
  Top 0.406: IC10.8 105.28,44.45 95.76,44.45 94.49,43.18 IC4.8 76.71,43.18 53.21,19.68 v53.21,19.05 | v46.23,15.88 44.96,14.61 44.96,8.26 U$2.DE1
  Bottom 0.406: v53.21,19.05 49.4,19.05 v46.23,15.88
!MA10  (via drill 0.81)
  Top 0.406: IC10.9 105.28,41.91 95.76,41.91 94.49,40.64 IC4.9 75.44,40.64 55.75,20.95 v55.75,20.32 | v40.51,15.88 39.24,14.61 39.24,8.26 U$2.DH1
  Bottom 0.406: v55.75,20.32 44.96,20.32 v40.51,15.88
!MA11  (via drill 0.81)
  Top 0.406: IC4.10 74.8,38.1 v58.29,21.59 | v37.34,15.88 36.07,14.61 36.07,8.26 U$2.DJ1
  Bottom 0.406: IC4.10 91.95,38.1 95.76,34.29 102.11,34.29 105.92,38.1 IC10.10 | v58.29,21.59 43.05,21.59 v37.34,15.88
!MD00  (via drill 0.81)
  Top 0.406: v232.28,36.83 v228.47,40.64 | v234.19,15.24 234.82,15.24 235.46,14.61 235.46,8.26 U$2.AK1
  Bottom 0.406: v228.47,40.64 E1.2 | v232.28,36.83 232.28,17.14 v234.19,15.24
!MD01  (via drill 0.81)
  Top 0.406: v231.01,15.24 231.65,15.24 232.28,14.61 232.28,8.26 U$2.AL1
  Bottom 0.406: E1.15 231.01,38.1 v231.01,15.24
!MD02  (via drill 0.81)
  Top 0.406: v227.84,15.24 228.47,15.24 229.11,14.61 229.11,8.26 U$2.AM1
  Bottom 0.406: E1.7 229.11,24.77 229.11,16.51 v227.84,15.24
!MD03  (via drill 0.81)
  Top 0.406: v227.84,19.68 E1.9 | v221.49,15.24 222.12,15.24 222.76,14.61 222.76,8.26 U$2.AP1
  Bottom 0.406: v227.84,19.68 224.66,19.68 221.49,16.51 v221.49,15.24
!MD04  (via drill 0.81)
  Top 0.406: v167.51,15.24 166.88,15.24 166.24,14.61 166.24,8.26 U$2.BK1
  Bottom 0.406: E2.2 159.26,43.18 160.53,44.45 161.8,44.45 162.43,43.81 162.43,25.4 164.34,23.5 164.34,18.41 v167.51,15.24
!MD05  (via drill 0.81)
  Top 0.406: v161.16,43.18 E2.15 | v164.34,15.24 163.7,15.24 163.07,14.61 163.07,8.26 U$2.BL1
  Bottom 0.406: v161.16,43.18 161.16,25.4 163.07,23.5 163.07,16.51 v164.34,15.24
!MD06  (via drill 0.81)
  Top 0.406: v161.16,15.24 160.53,15.24 159.89,14.61 159.89,8.26 U$2.BM1
  Bottom 0.406: E2.7 158.62,29.21 158.62,26.67 161.16,24.13 v161.16,15.24
!MD07  (via drill 0.81)
  Top 0.406: E2.9 159.26,27.94 v151.64,20.32 | v151.64,15.24 152.27,15.24 152.91,14.61 152.91,8.26 U$2.BP1
  Bottom 0.406: v151.64,15.24 v151.64,20.32
!MD08  (via drill 0.81)
  Top 0.406: E3.2 21.46,41.91 21.46,29.84 22.1,29.21 v34.16,29.21 | v34.16,15.88 32.89,14.61 32.89,8.26 U$2.DK1
  Bottom 0.406: v34.16,15.88 v34.16,29.21
!MD09  (via drill 0.81)
  Top 0.406: v30.99,15.88 29.72,14.61 29.72,8.26 U$2.DL1
  Bottom 0.406: E3.15 32.89,40.64 32.89,17.78 v30.99,15.88
!MD10  (via drill 0.81)
  Top 0.406: v27.81,15.88 26.54,14.61 26.54,8.26 U$2.DM1
  Bottom 0.406: E3.7 28.45,30.48 29.72,29.21 30.99,29.21 31.62,28.57 31.62,19.68 v27.81,15.88
!MD11  (via drill 0.81)
  Top 0.406: v18.29,15.24 18.92,15.24 19.56,14.61 19.56,8.26 U$2.DP1
  Bottom 0.406: E3.9 18.29,15.88 v18.29,15.24
!MINE
  Top 0.406: IC10.20 R1.1 | D1.A 258.95,72.39 | 258.95,72.39 D2.A D3.A D4.A D5.A D6.A D7.A D8.A | IC3.5 21.46,64.77 21.46,67.31 IC3.3 | 258.95,72.39 81.79,72.39 67.82,58.42 IC5.9
  Bottom 0.406: IC10.20 120.52,41.91 105.92,41.91 104.65,40.64 IC4.20 85.6,40.64 81.79,44.45 68.45,44.45 IC5.9 48.13,64.77 26.54,64.77 IC3.3
!ROM_ADDR  (via drill 0.81)
  Top 0.406: IC9.6 221.49,56.52 v221.49,36.83
  Bottom 0.406: v221.49,36.83 221.49,25.4 210.69,14.61 210.69,8.26 U$2.AU2
!WRITEP  (via drill 0.81)
  Top 0.406: IC10.27 111,58.42 105.92,63.5 95.12,63.5 v91.31,59.69
  Bottom 0.406: IC5.12 53.21,64.77 53.21,62.87 53.85,62.23 77.98,62.23 80.52,59.69 v91.31,59.69 95.12,59.69 IC4.27
-15V  (via drill 0.81)
  Top 0.762: v194.82,20.95 213.23,20.95 216.41,17.78 v224.66,17.78 | 236.09,17.78 246.25,17.78 248.79,20.32 v251.33,20.32 | 236.09,17.78 v227.84,17.78 | v120.52,20.95 v120.52,17.14 | v137.03,27.3 v126.87,27.3 | v231.01,47.62 236.09,42.55 236.09,17.78
  Bottom 0.762: 120.52,16.51 122.43,16.51 124.33,14.61 124.33,8.26 U$2.CB2 | 120.52,16.51 90.04,16.51 86.87,19.68 60.2,19.68 55.12,14.61 55.12,8.26 U$2.DB2 | v194.82,20.95 188.47,14.61 188.47,8.26 U$2.BB2 | v227.84,17.78 v224.66,17.78 | v251.33,20.32 253.24,20.32 257.68,15.88 257.68,8.26 U$2.AB2 | v120.52,17.14 120.52,16.51 | v126.87,27.3 v120.52,20.95 | v137.03,27.3 164.97,55.24 223.39,55.24 v231.01,47.62
BD00  (via drill 0.81)
  Top 0.406: v222.76,38.1 E1.3 | v203.71,38.1 202.44,38.1 201.17,39.37 199.9,39.37 194.18,45.09 194.18,46.99 IC1.2
  Bottom 0.406: v203.71,38.1 v222.76,38.1
BD01  (via drill 0.81)
  Top 0.406: v228.47,43.18 E1.14 | v203.71,40.01 204.98,38.73 204.98,37.47 204.34,36.83 199.9,36.83 193.55,43.18 IC1.4
  Bottom 0.406: v228.47,43.18 227.2,44.45 208.15,44.45 v203.71,40.01
BD02
  Top 0.406: E1.6 203.71,30.48 202.44,29.21 199.9,29.21 194.18,34.92 194.18,36.83 IC1.6
BD03
  Top 0.406: E1.10 227.84,27.94 226.57,29.21 203.71,29.21 201.17,26.67 199.26,26.67 IC1.8
BD04  (via drill 0.81)
  Top 0.406: E2.3 163.07,40.64 164.34,41.91 v185.29,41.91 | v211.96,36.83 v201.8,46.99 | v203.71,27.3 201.8,25.4 v199.26,25.4
  Bottom 0.406: v185.29,41.91 190.37,46.99 v201.8,46.99 | v211.96,36.83 211.96,35.56 v203.71,27.3 | v199.26,25.4 199.26,26.67 IC1.11
BD05
  Top 0.406: E2.14 190.37,40.64 191.64,41.91 193.55,41.91 199.26,36.2 199.26,34.29 IC1.13
BD06  (via drill 0.81)
  Top 0.406: E2.6 163.07,33.02 164.34,34.29 165.61,34.29 168.15,36.83 v168.15,38.1 | v189.74,44.45 193.55,44.45 199.9,38.1 IC1.15
  Bottom 0.406: v168.15,38.1 183.39,38.1 v189.74,44.45
BD07  (via drill 0.81)
  Top 0.406: E2.10 179.58,30.48 v188.47,39.37
  Bottom 0.406: v188.47,39.37 196.72,39.37 IC1.17
BD08
  Top 0.406: E3.3 25.91,40.64 29.72,44.45 41.78,44.45 IC2.2
BD09
  Top 0.406: E3.14 43.05,40.64 IC2.4
BD10
  Top 0.406: E3.6 25.91,33.02 29.72,36.83 43.69,36.83 44.96,38.1 IC2.6
BD11
  Top 0.406: E3.10 43.05,30.48 IC2.8
GND  (via drill 0.81)
  Top 0.762: 81.15,15.24 81.15,19.68 | 81.15,19.68 IC4.14 | 81.15,15.24 80.52,14.61 80.52,8.26 U$2.CT2 | 93.85,15.24 93.22,14.61 93.22,8.26 U$2.CN2 | 93.85,15.24 102.74,24.13 | 102.74,24.13 IC10.14 | 111.63,15.24 111.63,8.26 U$2.CF2 | 102.74,24.13 111.63,15.24 | 120.52,15.24 121.16,14.61 121.16,8.26 U$2.CC2 | 111.63,15.24 120.52,15.24 | 93.85,15.24 v88.14,15.24 81.15,15.24 | IC3.7 22.73,48.9 | 22.73,48.9 E3.1 | IC5.8 32.26,58.42 22.73,48.9 | U$2.DF2 42.42,8.26 v42.42,15.88 42.42,23.5 | 22.73,18.41 v22.73,15.88 22.73,8.26 U$2.DN2 | 22.73,18.41 22.73,26.67 | 22.73,26.67 E3.8 | 42.42,27.94 32.26,27.94 22.73,18.41 | 42.42,27.94 IC2.10 | 22.73,26.67 10.67,14.61 10.67,8.26 U$2.DT2 | 42.42,27.94 42.42,23.5 | 51.31,13.97 51.31,14.61 50.67,15.24 | 51.31,13.97 51.31,8.26 U$2.DC2 51.31,13.97 | 42.42,23.5 50.67,15.24 | 50.67,15.24 v51.31,15.88 | 81.15,19.68 57.02,19.68 51.31,13.97 | 144.65,15.24 145.92,16.51 154.18,16.51 156.08,14.61 | 144.65,15.24 144.02,14.61 144.02,8.26 U$2.BT2 | 156.08,14.61 156.08,8.26 U$2.BN2 | v175.77,16.51 175.77,8.26 U$2.BF2 | IC1.10 192.91,22.23 192.28,21.59 | 187.2,16.51 185.29,14.61 185.29,8.26 U$2.BC1 | 187.2,16.51 192.28,21.59 | 187.2,16.51 v175.77,16.51 | 156.08,14.61 157.99,16.51 v175.77,16.51 | 144.65,15.24 v144.02,15.88 | v255.14,15.88 255.14,8.26 U$2.AC1 | 245.62,15.24 245.62,8.26 U$2.AF2 | 245.62,15.24 v245.62,15.88 242.44,15.88 241.81,16.51 225.93,16.51 | v213.87,15.88 213.87,8.26 U$2.AT2 | IC9.4 IC9.5 | IC9.8 E1.1 | 225.93,16.51 v225.93,15.88 225.93,8.26 U$2.AN2 | 225.93,16.51 E1.8 | v213.87,15.88 220.22,15.88 220.85,16.51 225.93,16.51 | v251.33,17.78 248.16,17.78 245.62,15.24 | 192.28,21.59 194.18,19.68 210.06,19.68 v213.87,15.88
  Top 0.762: 120.52,15.24 131.32,26.04 155.45,26.04 E2.8
  Bottom 0.762: 91.95,15.24 v88.14,15.24 81.15,15.24 80.52,14.61 80.52,8.26 U$2.CT2 | 91.95,15.24 92.58,14.61 92.58,8.26 U$2.CN2 | 111,15.24 111.63,14.61 111.63,8.26 U$2.CF2 | 91.95,15.24 111,15.24 | 111,15.24 120.52,15.24 121.16,14.61 121.16,8.26 U$2.CC2 | v42.42,15.88 42.42,8.26 U$2.DF2 | E3.8 20.83,26.04 | 20.83,26.04 10.67,15.88 10.67,8.26 U$2.DT2 | v22.73,15.88 22.73,8.26 U$2.DN2 | v51.31,15.88 51.31,8.26 U$2.DC2 | E3.1 20.83,43.81 20.83,26.04 | E2.8 155.45,29.84 155.45,35.56 | 155.45,35.56 155.45,43.81 E2.1 | 155.45,35.56 148.46,35.56 144.02,31.11 144.02,29.84 | 144.02,29.84 v144.02,15.88 144.02,8.26 U$2.BT2 | 144.02,29.84 156.08,17.78 156.08,8.26 U$2.BN2 | v175.77,16.51 175.77,8.26 U$2.BF2 | IC1.10 185.29,20.32 185.29,8.26 U$2.BC1 | U$2.AC1 255.14,8.26 v255.14,15.88 253.24,15.88 v251.33,17.78 | v245.62,15.88 245.62,8.26 U$2.AF2 | v213.87,15.88 213.87,8.26 U$2.AT2 | IC9.5 224.03,61.59 224.03,57.78 IC9.8 | E1.1 224.03,41.27 224.03,27.3 E1.8 | v225.93,15.88 225.93,8.26 U$2.AN2
MEM00  (via drill 0.81)
  Top 0.406: v127.51,44.45 169.42,44.45 170.05,43.81 186.56,43.81 192.28,49.53 196.72,49.53 IC1.18 201.17,45.72 211.33,35.56 E1.4
  Bottom 0.406: IC4.15 101.47,33.02 102.11,33.02 105.92,36.83 118.62,36.83 121.16,39.37 122.43,39.37 v127.51,44.45
MEM01  (via drill 0.81)
  Top 0.406: IC4.13 79.88,31.75 79.88,36.2 80.52,36.83 93.22,36.83 95.76,39.37 111,39.37 121.16,29.21 157.99,29.21 159.26,30.48 163.07,30.48 164.34,31.75 v171.96,31.75 | E1.13 234.82,34.29 234.82,32.38 234.19,31.75 231.65,31.75 229.11,34.29 211.33,34.29 204.34,41.27 201.17,41.27 IC1.16
  Bottom 0.406: v171.96,31.75 174.5,34.29 194.18,34.29 IC1.16
MEM02  (via drill 0.81)
  Top 0.406: v126.87,19.68 128.78,19.68 131.32,22.23 147.83,22.23 151,19.05 178.94,19.05 v191.64,31.75 | E1.5 203.07,33.02 IC1.14
  Bottom 0.406: IC4.12 94.49,19.68 v126.87,19.68 | v191.64,31.75 196.72,31.75 IC1.14
MEM03  (via drill 0.81)
  Top 0.406: IC1.12 202.44,30.48 203.71,31.75 230.38,31.75 231.65,30.48 E1.11 | IC4.11 85.6,31.11 85.6,22.86 v90.04,18.41 | v125.6,18.41 128.78,18.41 131.32,20.95 147.83,20.95 151,17.78 v186.56,17.78
  Bottom 0.406: v125.6,18.41 v90.04,18.41 | v186.56,17.78 187.83,17.78 IC1.12
MEM04  (via drill 0.81)
  Top 0.406: v126.87,36.83 142.75,36.83 144.02,38.1 E2.4 157.99,38.1 159.26,36.83 165.61,36.83 166.24,37.47 166.24,38.1 167.51,39.37 168.78,39.37 v175.13,33.02
  Bottom 0.406: IC10.19 125.6,38.1 v126.87,36.83 | IC1.9 181.48,30.48 178.94,33.02 v175.13,33.02
MEM05
  Top 0.406: IC10.18 123.7,35.56 127.51,39.37 163.7,39.37 E2.13
  Bottom 0.406: IC1.7 167.51,35.56 E2.13
MEM06  (via drill 0.81)
  Top 0.406: 149.73,33.02 154.81,33.02 E2.5 | 149.73,33.02 IC10.17 | IC1.5 191.64,40.64 175.77,24.77 157.99,24.77 v157.35,24.13 | 149.73,33.02 v149.73,31.75
  Bottom 0.406: v149.73,31.75 v157.35,24.13
MEM07  (via drill 0.81)
  Top 0.406: IC10.16 155.45,30.48 156.72,31.75 163.07,31.75 164.34,33.02 E2.11 165.61,33.02 v169.42,36.83
  Bottom 0.406: IC1.3 184.02,36.83 v169.42,36.83
MEM08  (via drill 0.81)
  Top 0.406: E3.4 25.91,38.1 29.72,41.91 42.42,41.91 44.96,44.45 51.94,44.45 IC2.18 | IC10.15 116.08,27.94 107.19,36.83 v97.66,36.83
  Bottom 0.406: v97.66,36.83 94.49,36.83 91.95,39.37 59.56,39.37 IC2.18
MEM09  (via drill 0.81)
  Top 0.406: E3.13 43.69,38.1 44.96,39.37 51.94,39.37 IC2.16 | IC10.13 104.01,30.48 90.68,17.14 89.41,17.14 v82.42,24.13
  Bottom 0.406: v82.42,24.13 67.82,24.13 54.48,37.47 54.48,39.37 IC2.16
MEM10  (via drill 0.81)
  Top 0.406: E3.5 25.91,35.56 29.72,39.37 v43.05,39.37 | IC10.12 103.38,33.02 v91.31,20.95
  Bottom 0.406: v43.05,39.37 49.4,39.37 IC2.14 67.82,20.95 v91.31,20.95
MEM11  (via drill 0.81)
  Top 0.406: E3.11 43.69,33.02 44.96,34.29 49.4,34.29 | IC2.12 49.4,34.29 | 49.4,34.29 v59.56,34.29
  Bottom 0.406: IC10.11 97.66,26.67 89.41,26.67 81.79,34.29 v59.56,34.29
N$1
  Top 0.406: IC9.7 229.11,58.42 232.92,54.61 239.9,54.61 SV2.2
N$18
  Bottom 0.406: IC9.9 238.63,55.88 SV2.4
N$19
  Top 0.406: IC9.10 238.63,58.42 SV2.6
N$20
  Top 0.406: IC9.11 238.63,60.96 SV2.8
N$21
  Bottom 0.406: IC9.12 238.63,63.5 SV2.10
N$22
  Top 0.406: IC9.13 238.63,66.04 SV2.12
N$23
  Top 0.406: IC9.14 238.63,68.58 SV2.14
N$24
  Bottom 0.406: IC9.15 238.63,71.12 SV2.16
N$25
  Top 0.406: C1.1 R3.2 IC5.7
N$26
  Top 0.406: SV2.1 D8.C
N$27
  Top 0.406: SV2.3 D7.C
N$28
  Top 0.406: SV2.5 D6.C
N$29
  Top 0.406: SV2.7 D5.C
N$30
  Top 0.406: SV2.9 D4.C
N$31
  Top 0.406: SV2.11 D3.C
N$32
  Top 0.406: SV2.13 D2.C
N$33
  Top 0.406: SV2.15 D1.C
N$34
  Top 0.406: C1.2 44.32,66.04 IC5.6
N$35
  Top 0.406: IC4.16 IC4.17 IC4.18 IC4.19 R2.1
READ  (via drill 0.81)
  Top 0.406: IC3.6 24,62.23 24,72.39 IC3.1 | E1.12 227.2,39.37 v227.2,47.62 | E3.12 43.69,35.56 44.96,36.83 55.12,36.83 83.06,64.77 155.45,64.77 v168.78,51.44
  Bottom 0.406: E3.12 24,41.91 24,59.69 IC3.6 | v227.2,47.62 205.61,47.62 199.26,53.98 171.32,53.98 v168.78,51.44 163.7,46.35 163.7,36.83 E2.12
VCC
  Top 0.762: IC3.14 37.97,73.66 39.88,71.75 | R3.1 39.88,71.75 | E3.16 36.7,45.72 47.5,56.52 | IC5.11 52.58,61.59 | 52.58,61.59 47.5,56.52 | 47.5,56.52 IC2.20 | 52.58,74.3 IC5.16 | 52.58,61.59 52.58,74.3 | 39.88,71.75 46.23,78.11 48.77,78.11 52.58,74.3 | E2.16 159.26,45.72 154.18,50.8 R1.2
  Bottom 0.762: 233.55,46.35 233.55,53.98 231.65,55.88 231.65,71.75 IC9.16 | 233.55,46.35 E1.16 260.86,15.88 260.86,8.26 U$2.AA2 | 204.98,46.35 IC1.20 194.82,50.8 192.91,52.7 171.96,52.7 E2.16 | 233.55,46.35 204.98,46.35 | 204.98,46.35 202.44,43.81 202.44,26.67 191.64,15.88 191.64,8.26 U$2.BA2 | R2.2 101.47,55.88 100.2,57.15 | 100.2,57.15 IC4.28 93.85,63.5 IC5.11 | 100.2,57.15 105.92,62.87 119.89,62.87 IC10.28 126.87,55.88 R1.2 128.78,48.9 128.78,40.64 128.14,40.01 128.14,8.26 U$2.CA2
WRITE  (via drill 0.81)
  Top 0.406: IC4.22 102.11,45.72 105.92,49.53 107.19,49.53 111,45.72 IC10.22 v152.27,45.72 | v217.04,27.94 v217.04,19.05 | v197.36,56.52 v217.04,36.83
  Bottom 0.406: IC5.10 66.55,60.96 80.52,46.99 94.49,46.99 95.76,45.72 IC4.22 | v217.04,19.05 217.04,8.26 U$2.AS2 | v217.04,36.83 v217.04,27.94 | v197.36,56.52 163.07,56.52 v152.27,45.72
WRITEM
  Top 0.406: IC1.19 197.99,50.8 IC1.1 171.32,50.8 156.08,66.04 77.98,66.04 61.47,49.53 46.86,49.53 IC2.1
  Bottom 0.406: IC3.4 29.08,59.69 36.7,59.69 IC2.1